# Altium schematic sheet Boris_IO_2.SchDoc: Boris IO
size A4; Date: 2017.12.10; DrawnBy: Miklós Árpád; Revision: 1.0; SheetNumber: 2; SheetTotal: 5; PageSetup: Record=PageOptions|CenterHorizontal=True|CenterVertical=True|PrintScale=1.00|XCorrection=1.00|YCorrection=1.00|PrintKind=0|BorderSize=5000000|LeftOffset=0|BottomOffset=0|Orientation=2|PaperLength=1000|PaperWidth=1000|Scale=100|PaperSource=7|PrintQuality=-4|MediaType=1|DitherType=10|PaperKind=A4|PrintScaleMode=0
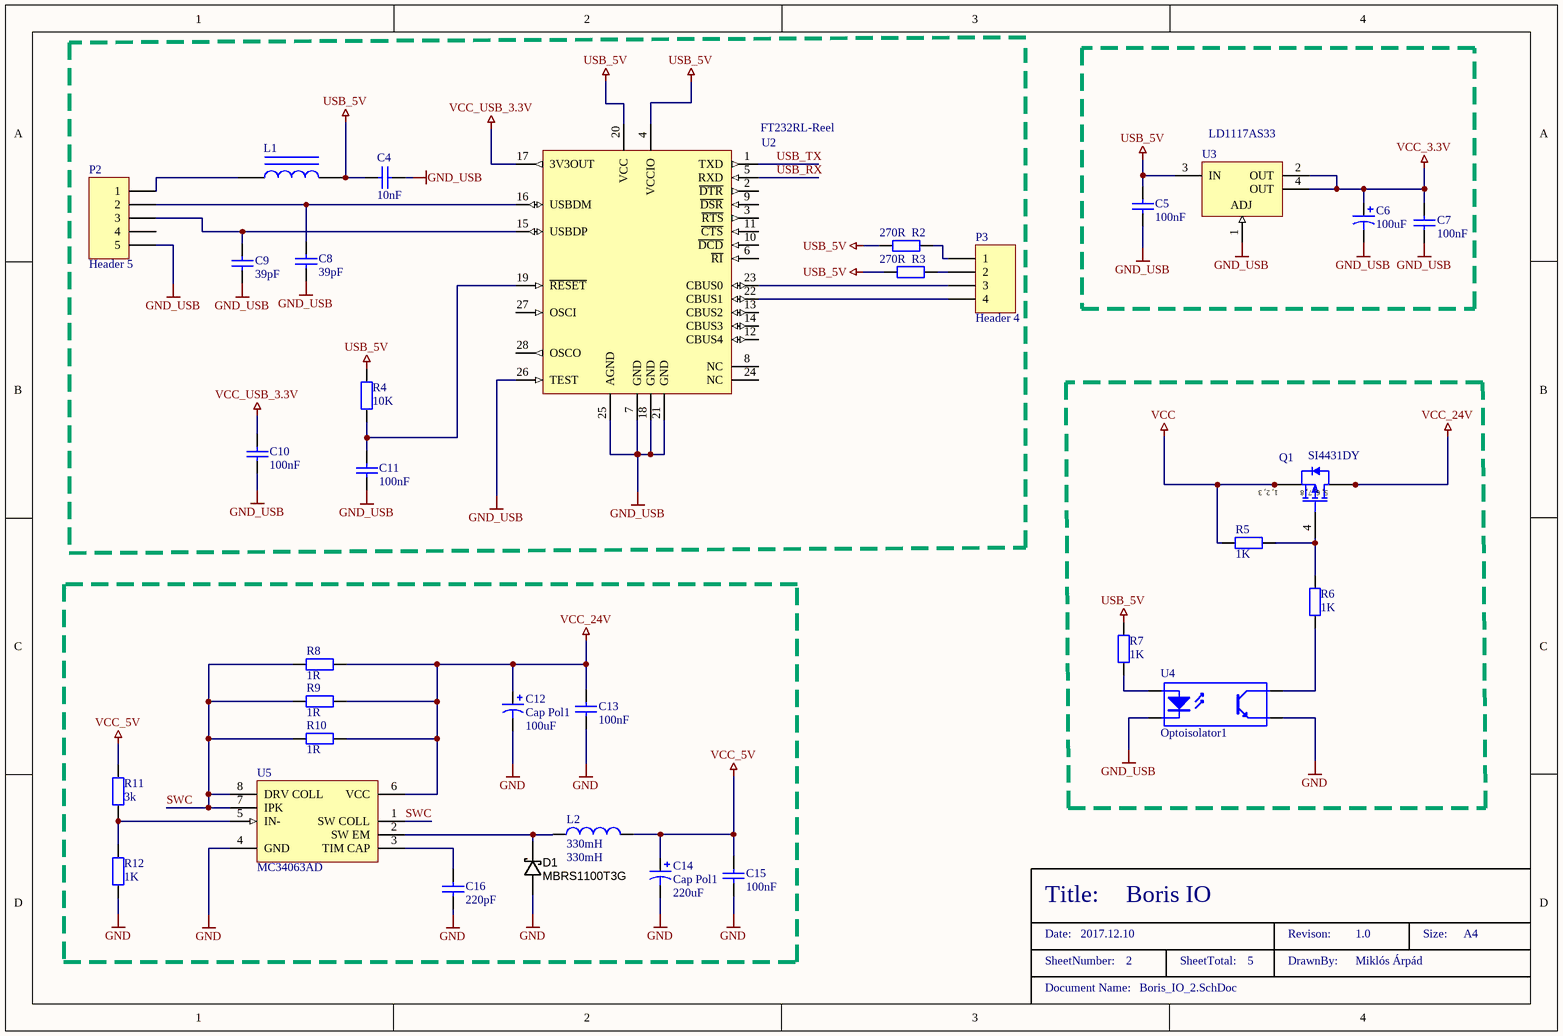
[diagram p0: Boris_IO_2.SchDoc]

## Parts
C4  10nF  [0805_CAP]
C5  100nF  [0805_CAP]
C6  100uF  [7343]
C7  100nF  [0805_CAP]
C8  39pF  [0805_CAP]
C9  39pF  [0805_CAP]
C10  100nF  [0805_CAP]
C11  100nF  [0805_CAP]
C12  Cap Pol1  value 100uF  [CAP_ELEC_SIZE_G]
C13  100nF  [CAPC3216N]
C14  Cap Pol1  value 220uF  [CAP_ELEC_SIZE_E]
C15  100nF  [CAPC3216N]
C16  220pF  [0805_CAP]
D1  MBRS1100T3G  [DO-214AA]
L1  Inductor Iron  [0805_ind]  (value not drawn)
L2  330mH  [IND_Coilcraft_DO3316P_SM]
P2  Header 5  [HDR1X5]
P3  Header 4  [HDR1X4]
Q1  SI4431DY  [SO-8_N]
R2  270R  [0805_RES]
R3  270R  [0805_RES]
R4  10K  [0805_RES]
R5  1K  [RESC3216N]
R6  1K  [RESC3216N]
R7  1K  [RESC3216N]
R8  1R  [RESC3216N]
R9  1R  [RESC3216N]
R10  1R  [RESC3216N]
R11  3k  [RESC3216N]
R12  1K  [RESC3216N]
U2  FT232RL-Reel  [SSOP-28_N]
U3  LD1117AS33  [318E-04]
U4  Optoisolator1  [DIP-4]
U5  MC34063AD  [751-05_N]

## Nets
GND: C12.2 C13.2 C14.2 C15.2 C16.2 D1.A R12.2 U4.3(E) U5.4(GND)
GND_USB: C4.2 C5.2 C6.2 C7.2 C8.1 C9.1 C10.2 C11.2 P2.5 U2.7(GND) U2.18(GND) U2.21(GND) U2.25(AGND) U2.26(TEST) U3.1(ADJ) U4.2(K)
USB_5V: C4.1 C5.1 L1.2 R2.1 R3.1 R4.2 R7.1 U2.4(VCCIO) U2.20(VCC) U3.3(IN)
VCC: Q1.1(S) Q1.2(S) Q1.3(S) R5.1
VCC_3.3V: C6.1 C7.1 U3.2(OUT) U3.4(OUT)
VCC_5V: C14.1 C15.1 L2.2 R11.1
VCC_24V: C12.1 C13.1 Q1.5(D) Q1.6(D) Q1.7(D) Q1.8(D) R8.1 R9.1 R10.1 U5.6(VCC)
VCC_USB_3.3V: C10.1 U2.17(3V3OUT)
SWC: R8.2 R9.2 R10.2 U5.1(SW_COLL) U5.7(IPK) U5.8(DRV_COLL)
USB_RX: U2.5(RXD)
USB_TX: U2.1(TXD)
NetC8_2: C8.2 P2.2 U2.16(USBDM)
NetC9_2: C9.2 P2.3 U2.15(USBDP)
NetC11_1: C11.1 R4.1 U2.19(~{RESET})
NetC16_1: C16.1 U5.3(TIM_CAP)
NetD1_K: D1.K L2.1 U5.2(SW_EM)
NetL1_1: L1.1 P2.1
NetP3_1: P3.1 R2.2
NetP3_2: P3.2 R3.2
NetP3_3: P3.3 U2.23(CBUS0)
NetP3_4: P3.4 U2.22(CBUS1)
NetQ1_4: Q1.4(G) R5.2 R6.1
NetR6_2: R6.2 U4.4(C)
NetR7_2: R7.2 U4.1(A)
NetR11_2: R11.2 R12.1 U5.5(IN-)

Not connected (* = marked no-connect by the designer): P2 4; U2 2(~{DTR}) 3(~{RTS}) 6(~{RI}) 8(NC) 9(~{DSR}) 10(~{DCD}) 11(~{CTS}) 12(CBUS4) 13(CBUS2) 14(CBUS3) 24(NC) 27(OSCI) 28(OSCO)

## Notes on the sheet
- Title:
- Date:
- SheetNumber:
- Document Name:
- SheetTotal:
- Revison:
- DrawnBy:
- Size:
- A4
- (in symbol SI4431DY) 1, 2, 3; 5, 6, 7, 8

## Library data of the parts
C4 C5 C7-C11 C13 C15 C16 = Cap: Capacitor; Distributor: RET
  C4: Value: 10nF; Catalog Number: 93-01-91; Name: 10nF
  C5 C7 C10 C11: Value: 100nF; Catalog Number: 93-04-28; Name: 100nF
  C8 C9: Value: 39pF; Catalog Number: 93-01-93; Name: 39pF
  C13 C15: Value: 100nF; Catalog Number: 93-01-37; Name: 100nF
  C16: Value: 220pF; Catalog Number: 93-00-91; Name: 220pF
C6 C12 C14 = Cap Pol1: Polarized Capacitor (Radial); Distributor: RET
  C6: Value: 100uF; Catalog Number: 93-03-66; Name: 100uF
  C12: Catalog Number: 97-01-16; Name: 100uF
  C14: Catalog Number: 97-00-69; Name: 220uF
D1 = DIODE_SCHOTTKY_MBRS130L: Diode Schottky SMD 30V 1A DO-214AA; Name: MBRS1100T3G; Catalog Number: MBRS1100T3G; Distributor: TME
L1 = Inductor Iron: Magnetic-Core Inductor; Value: 120R; Catalog Number: 77-00-76; Distributor: RET; Name: 120R
L2 = Inductor: Value: 330mH; Catalog Number: 77-00-89; Distributor: RET; Name: 330mH
P2 = Header 5: Header, 5-Pin; LatestRevisionDate: 17-Jul-2002; LatestRevisionNote: Re-released for DXP Platform.; Publisher: Altium Limited
P3 = Header 4: Header, 4-Pin; LatestRevisionDate: 17-Jul-2002; LatestRevisionNote: Re-released for DXP Platform.; Publisher: Altium Limited
Q1 = SI4431DY: P-Channel 30V (D-S)  MOSFET; Published: 8-Jun-2000; LatestRevisionDate: 13-Apr-2006; LatestRevisionNote: IPC-7351 Footprint Added.; DatasheetVersion: 6-Oct-1997; PackageVersion: Aug-1998; PackageReference: SO-8; Publisher: Altium Limited; PackageDescription: 8-Pin Small Outline Integrated Circuit 1.27 mm Pitch; ComponentLink1Description: Manufacturer Link; ComponentLink1URL: http://www.vishay.com/; ComponentLink2Description: Datasheet; ComponentLink2URL: http://www.vishay.com/docs/70151/70151.pdf
R2-R7 R11 R12 = Res2: Resistor; Distributor: RET
  R2 R3: Value: 270R; Catalog Number: 92-00-31; Name: 270R
  R4: Value: 10K; Catalog Number: 92-02-23; Name: 10K
  R5-R7 R12: Value: 1K; Catalog Number: 92-00-38; Name: 1K
  R11: Value: 3k; Catalog Number: 92-01-33; Name: 3k
R8-R10 = Res2: Resistor; Catalog Number: RC1206JR-071RL; Value: 1R; Distributor: TME; Name: 1R
U2 = FT232RL-Reel: USB UART Asynchronous Serial Data Transfer Chip, SSOP-28, Tape and Reel; Catalog Number: FT232RL; Distributor: TME; Name: FT232RL
U3 = LM317MBSTT3: Three-Terminal Adjustable Output Positive Voltage Regulator; Catalog Number: LD1117AS33; Distributor: TME; Name: LD1117AS33
U4 = Optoisolator1: 4-Pin Phototransistor Optocoupler; Published: 24-Mar-1999; LatestRevisionDate: 04-Mar-2005; LatestRevisionNote: Sch pins 3 & 4 Swapped.; DatasheetVersion: Nov-2003; PackageReference: DIP-4; Publisher: Altium Limited
U5 = MC34063AD: DC-to-DC Converter Control Circuit; Catalog Number: MC34063AD; Distributor: TME; Name: MC34063AD